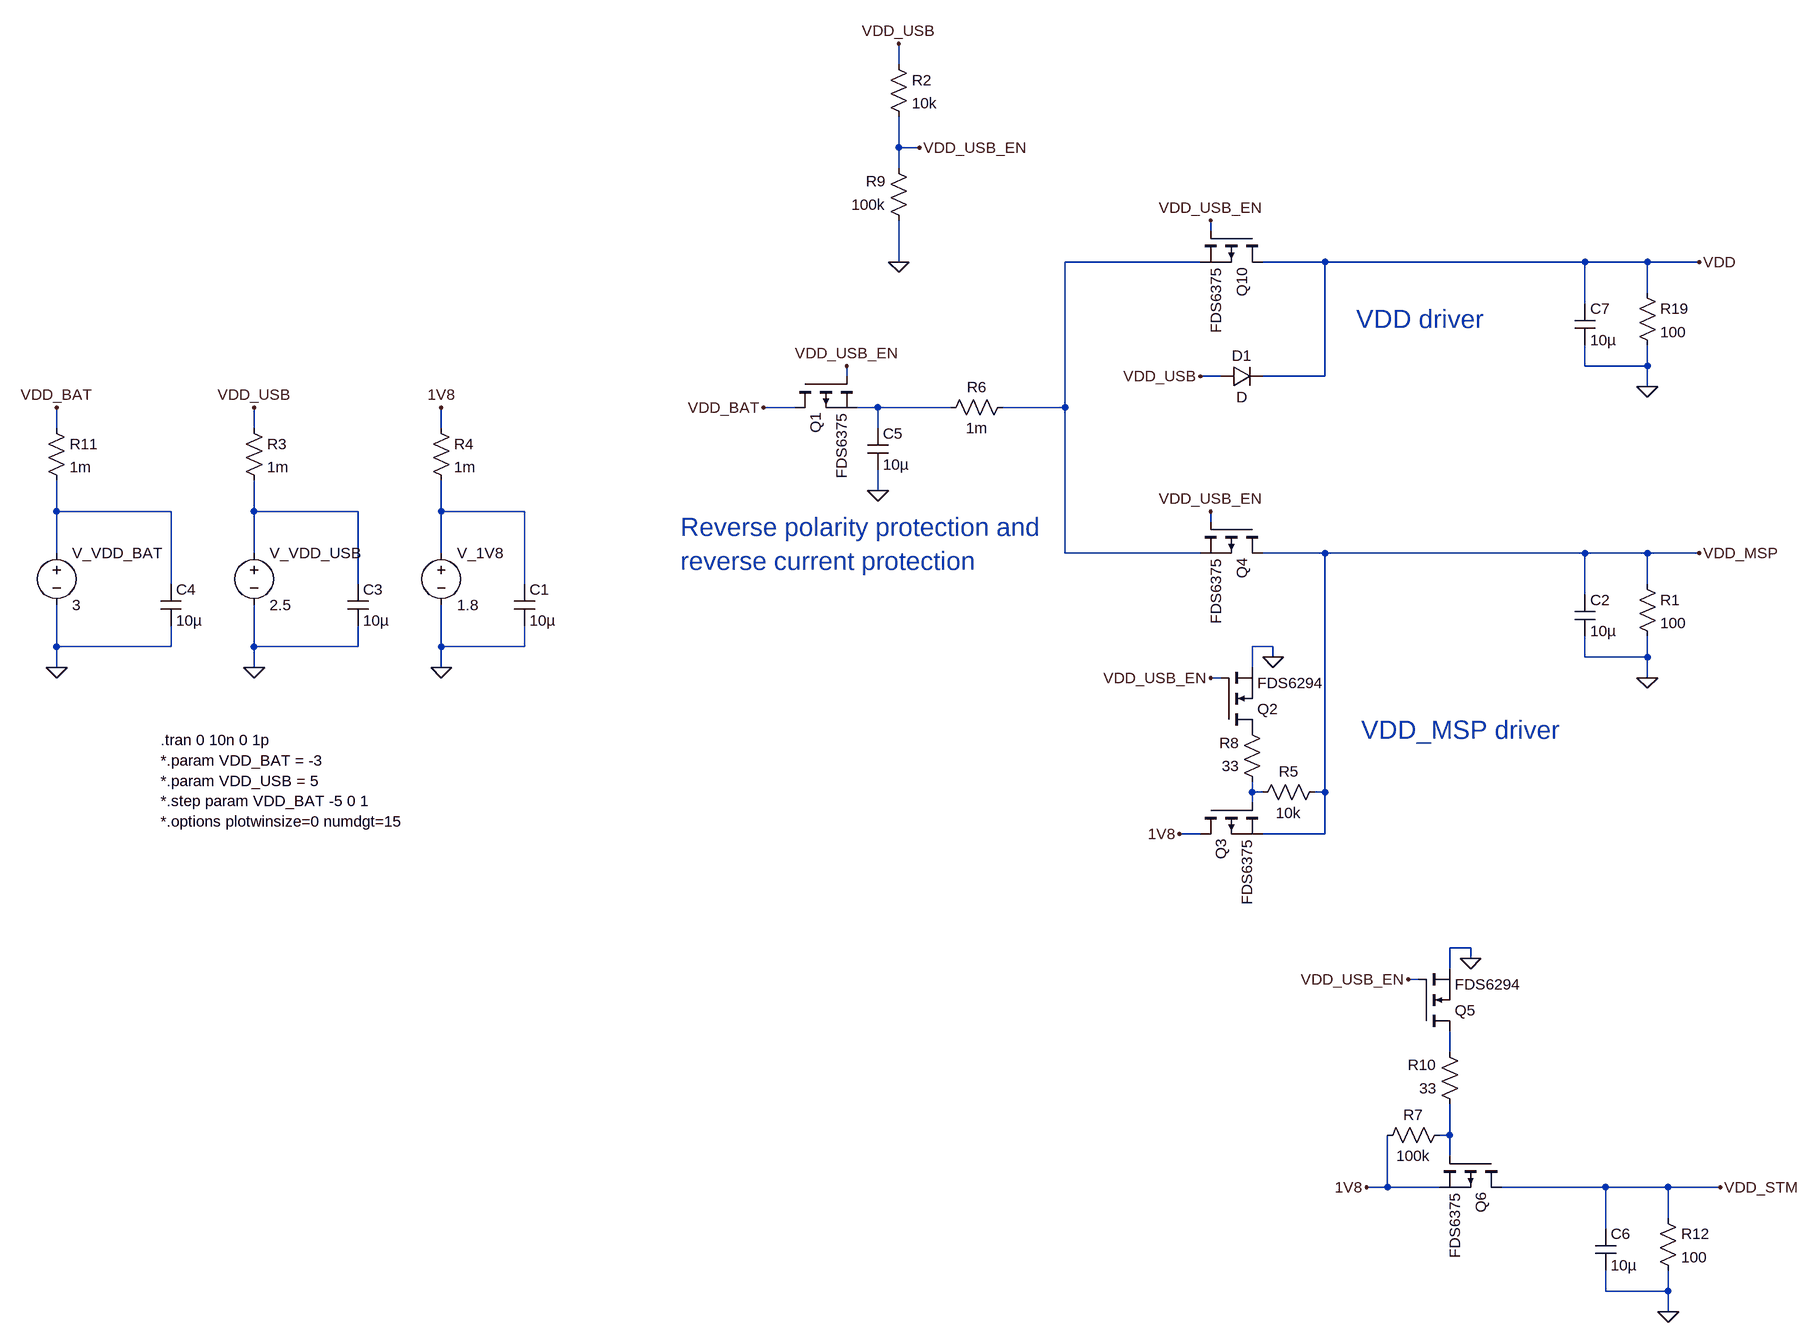
[diagram p0: schematic Schematic.asc]
Schematic.asc, the LTspice schematic file:
Version 4
SHEET 1 1688 864
WIRE -864 -1120 -864 -1152
WIRE -864 -992 -864 -1040
WIRE -832 -992 -864 -992
WIRE -864 -960 -864 -992
WIRE -384 -864 -384 -880
WIRE -864 -816 -864 -880
WIRE -400 -816 -608 -816
WIRE -208 -816 -304 -816
WIRE 192 -816 -208 -816
WIRE 288 -816 192 -816
WIRE 368 -816 288 -816
WIRE 288 -768 288 -816
WIRE 192 -752 192 -816
WIRE 192 -656 192 -688
WIRE 288 -656 288 -688
WIRE 288 -656 192 -656
WIRE -944 -640 -944 -656
WIRE -368 -640 -400 -640
WIRE -208 -640 -208 -816
WIRE -208 -640 -304 -640
WIRE 288 -624 288 -656
WIRE -1024 -592 -1072 -592
WIRE -896 -592 -928 -592
WIRE -784 -592 -896 -592
WIRE -608 -592 -608 -816
WIRE -608 -592 -704 -592
WIRE -2160 -560 -2160 -592
WIRE -1856 -560 -1856 -592
WIRE -1568 -560 -1568 -592
WIRE -896 -560 -896 -592
WIRE -896 -464 -896 -496
WIRE -2160 -432 -2160 -480
WIRE -1984 -432 -2160 -432
WIRE -1856 -432 -1856 -480
WIRE -1696 -432 -1856 -432
WIRE -1568 -432 -1568 -480
WIRE -1440 -432 -1568 -432
WIRE -384 -416 -384 -432
WIRE -2160 -368 -2160 -432
WIRE -1856 -368 -1856 -432
WIRE -1568 -368 -1568 -432
WIRE -608 -368 -608 -592
WIRE -400 -368 -608 -368
WIRE -208 -368 -304 -368
WIRE 192 -368 -208 -368
WIRE 288 -368 192 -368
WIRE 368 -368 288 -368
WIRE -1984 -320 -1984 -432
WIRE -1696 -320 -1696 -432
WIRE -1440 -320 -1440 -432
WIRE 288 -320 288 -368
WIRE 192 -304 192 -368
WIRE -2160 -224 -2160 -288
WIRE -1984 -224 -1984 -256
WIRE -1984 -224 -2160 -224
WIRE -1856 -224 -1856 -288
WIRE -1696 -224 -1696 -256
WIRE -1696 -224 -1856 -224
WIRE -1568 -224 -1568 -288
WIRE -1440 -224 -1440 -256
WIRE -1440 -224 -1568 -224
WIRE -288 -224 -320 -224
WIRE -288 -208 -288 -224
WIRE 192 -208 192 -240
WIRE 288 -208 288 -240
WIRE 288 -208 192 -208
WIRE -2160 -192 -2160 -224
WIRE -1856 -192 -1856 -224
WIRE -1568 -192 -1568 -224
WIRE -320 -192 -320 -224
WIRE -368 -176 -384 -176
WIRE 288 -176 288 -208
WIRE -320 0 -320 -16
WIRE -304 0 -320 0
WIRE -208 0 -208 -368
WIRE -208 0 -224 0
WIRE -320 16 -320 0
WIRE -400 64 -432 64
WIRE -208 64 -208 0
WIRE -208 64 -304 64
WIRE 16 240 -16 240
WIRE 16 256 16 240
WIRE -16 272 -16 240
WIRE -64 288 -80 288
WIRE -16 400 -16 368
WIRE -16 528 -16 480
WIRE -16 528 -32 528
WIRE -16 560 -16 528
WIRE -112 608 -112 528
WIRE -112 608 -144 608
WIRE -32 608 -112 608
WIRE 224 608 64 608
WIRE 320 608 224 608
WIRE 400 608 320 608
WIRE 320 656 320 608
WIRE 224 672 224 608
WIRE 224 768 224 736
WIRE 320 768 320 736
WIRE 320 768 224 768
WIRE 320 800 320 768
FLAG 368 -368 VDD_MSP
FLAG -1856 -192 0
FLAG -2160 -192 0
FLAG -1568 -192 0
FLAG 288 -176 0
FLAG -864 -1152 VDD_USB
FLAG -1856 -592 VDD_USB
FLAG -1568 -592 1V8
FLAG -1072 -592 VDD_BAT
FLAG -2160 -592 VDD_BAT
FLAG -896 -464 0
FLAG -864 -816 0
FLAG 368 -816 VDD
FLAG 288 -624 0
FLAG -832 -992 VDD_USB_EN
FLAG -384 -880 VDD_USB_EN
FLAG -944 -656 VDD_USB_EN
FLAG -432 64 1V8
FLAG -288 -208 0
FLAG -384 -432 VDD_USB_EN
FLAG -384 -176 VDD_USB_EN
FLAG -400 -640 VDD_USB
FLAG 16 256 0
FLAG -80 288 VDD_USB_EN
FLAG 320 800 0
FLAG 400 608 VDD_STM
FLAG -144 608 1V8
SYMBOL res 272 -336 R0
SYMATTR InstName R1
SYMATTR Value 100
SYMBOL res -880 -1136 R0
SYMATTR InstName R2
SYMATTR Value 10k
SYMBOL res -1872 -576 R0
SYMATTR InstName R3
SYMATTR Value 1m
SYMBOL cap 176 -304 R0
SYMATTR InstName C2
SYMATTR Value 10µ
SYMBOL cap -1456 -320 R0
SYMATTR InstName C1
SYMATTR Value 10µ
SYMBOL cap -1712 -320 R0
SYMATTR InstName C3
SYMATTR Value 10µ
SYMBOL cap -2000 -320 R0
SYMATTR InstName C4
SYMATTR Value 10µ
SYMBOL res -2176 -576 R0
SYMATTR InstName R11
SYMATTR Value 1m
SYMBOL voltage -2160 -384 R0
SYMATTR InstName V_VDD_BAT
SYMATTR Value 3
SYMATTR SpiceLine Cpar=1f
SYMBOL voltage -1856 -384 R0
SYMATTR InstName V_VDD_USB
SYMATTR Value 2.5
SYMBOL voltage -1568 -384 R0
SYMATTR InstName V_1V8
SYMATTR Value 1.8
SYMBOL res -1584 -576 R0
SYMATTR InstName R4
SYMATTR Value 1m
SYMBOL pmos -1024 -640 M90
SYMATTR InstName Q1
SYMATTR Value FDS6375
SYMBOL cap -912 -560 R0
SYMATTR InstName C5
SYMATTR Value 10µ
SYMBOL res -848 -864 R180
WINDOW 0 36 76 Left 2
WINDOW 3 36 40 Left 2
SYMATTR InstName R9
SYMATTR Value 100k
SYMBOL res 272 -784 R0
SYMATTR InstName R19
SYMATTR Value 100
SYMBOL cap 176 -752 R0
SYMATTR InstName C7
SYMATTR Value 10µ
SYMBOL pmos -304 -864 R90
SYMATTR InstName Q10
SYMATTR Value FDS6375
SYMBOL res -688 -608 R90
WINDOW 0 0 56 VBottom 2
WINDOW 3 32 56 VTop 2
SYMATTR InstName R6
SYMATTR Value 1m
SYMBOL res -208 -16 R90
WINDOW 0 0 56 VBottom 2
WINDOW 3 32 56 VTop 2
SYMATTR InstName R5
SYMATTR Value 10k
SYMBOL nmos -368 -96 M180
SYMATTR InstName Q2
SYMATTR Value FDS6294
SYMBOL pmos -400 16 M90
SYMATTR InstName Q3
SYMATTR Value FDS6375
SYMBOL pmos -304 -416 R90
SYMATTR InstName Q4
SYMATTR Value FDS6375
SYMBOL res -304 0 R180
WINDOW 0 36 76 Left 2
WINDOW 3 36 40 Left 2
SYMATTR InstName R8
SYMATTR Value 33
SYMBOL diode -368 -624 R270
WINDOW 0 32 32 VTop 2
WINDOW 3 0 32 VBottom 2
SYMATTR InstName D1
SYMBOL res -16 512 R90
WINDOW 0 0 56 VBottom 2
WINDOW 3 32 56 VTop 2
SYMATTR InstName R7
SYMATTR Value 100k
SYMBOL nmos -64 368 M180
SYMATTR InstName Q5
SYMATTR Value FDS6294
SYMBOL pmos 64 560 R90
SYMATTR InstName Q6
SYMATTR Value FDS6375
SYMBOL res 0 496 R180
WINDOW 0 36 76 Left 2
WINDOW 3 36 40 Left 2
SYMATTR InstName R10
SYMATTR Value 33
SYMBOL res 304 640 R0
SYMATTR InstName R12
SYMATTR Value 100
SYMBOL cap 208 672 R0
SYMATTR InstName C6
SYMATTR Value 10µ
TEXT -2000 -80 Left 2 !.tran 0 10n 0 1p\n*.param VDD_BAT = -3\n*.param VDD_USB = 5\n*.step param VDD_BAT -5 0 1\n*.options plotwinsize=0 numdgt=15
TEXT -1200 -408 Left 4 ;Reverse polarity protection and\nreverse current protection
TEXT -160 -728 Left 4 ;VDD driver
TEXT -152 -96 Left 4 ;VDD_MSP driver

The netlist it stands for:
* Schematic.asc
R1 VDD_MSP 0 100
R2 VDD_USB VDD_USB_EN 10k
R3 VDD_USB N004 1m
C2 VDD_MSP 0 10µ
C1 N005 0 10µ
C3 N004 0 10µ
C4 N003 0 10µ
R11 VDD_BAT N003 1m
V_VDD_BAT N003 0 3 Cpar=1f
V_VDD_USB N004 0 2.5
V_1V8 N005 0 1.8
R4 1V8 N005 1m
M§Q1 VDD_BAT VDD_USB_EN N002 N002 FDS6375
C5 N002 0 10µ
R9 0 VDD_USB_EN 100k
R19 VDD 0 100
C7 VDD 0 10µ
M§Q10 VDD VDD_USB_EN N001 N001 FDS6375
R6 N001 N002 1m
R5 VDD_MSP N006 10k
M§Q2 P001 VDD_USB_EN 0 0 FDS6294
M§Q3 1V8 N006 VDD_MSP VDD_MSP FDS6375
M§Q4 VDD_MSP VDD_USB_EN N001 N001 FDS6375
R8 N006 P001 33
D1 VDD_USB VDD D
R7 N008 1V8 100k
M§Q5 N007 VDD_USB_EN 0 0 FDS6294
M§Q6 VDD_STM N008 1V8 1V8 FDS6375
R10 N008 N007 33
R12 VDD_STM 0 100
C6 VDD_STM 0 10µ
.model D D
.lib standard.dio
.model NMOS NMOS
.model PMOS PMOS
.lib standard.mos
.tran 0 10n 0 1p
*.param VDD_BAT = -3
*.param VDD_USB = 5
*.step param VDD_BAT -5 0 1
*.options plotwinsize=0 numdgt=15
* Reverse polarity protection and
* reverse current protection
* VDD driver
* VDD_MSP driver
.backanno
.end